# Altium schematic sheet 00-Revision_History_and_Contents.SchDoc: Revision History and Contents
size A; Date: 4/25/2017; ApprovedBy: JSK; CheckedBy: JSK; Author: JSK; CompanyName: University of Wisconsin; DrawnBy: JSK; Engineer: JSK; Organization: ECE 315; Address1: College of Engineering; Address2: 1415 Engineering Drive; Address3: Madison, WI 53706; Address4: ECE 453 Spring 2017; Revision: A; SheetNumber: 1; SheetTotal: 11
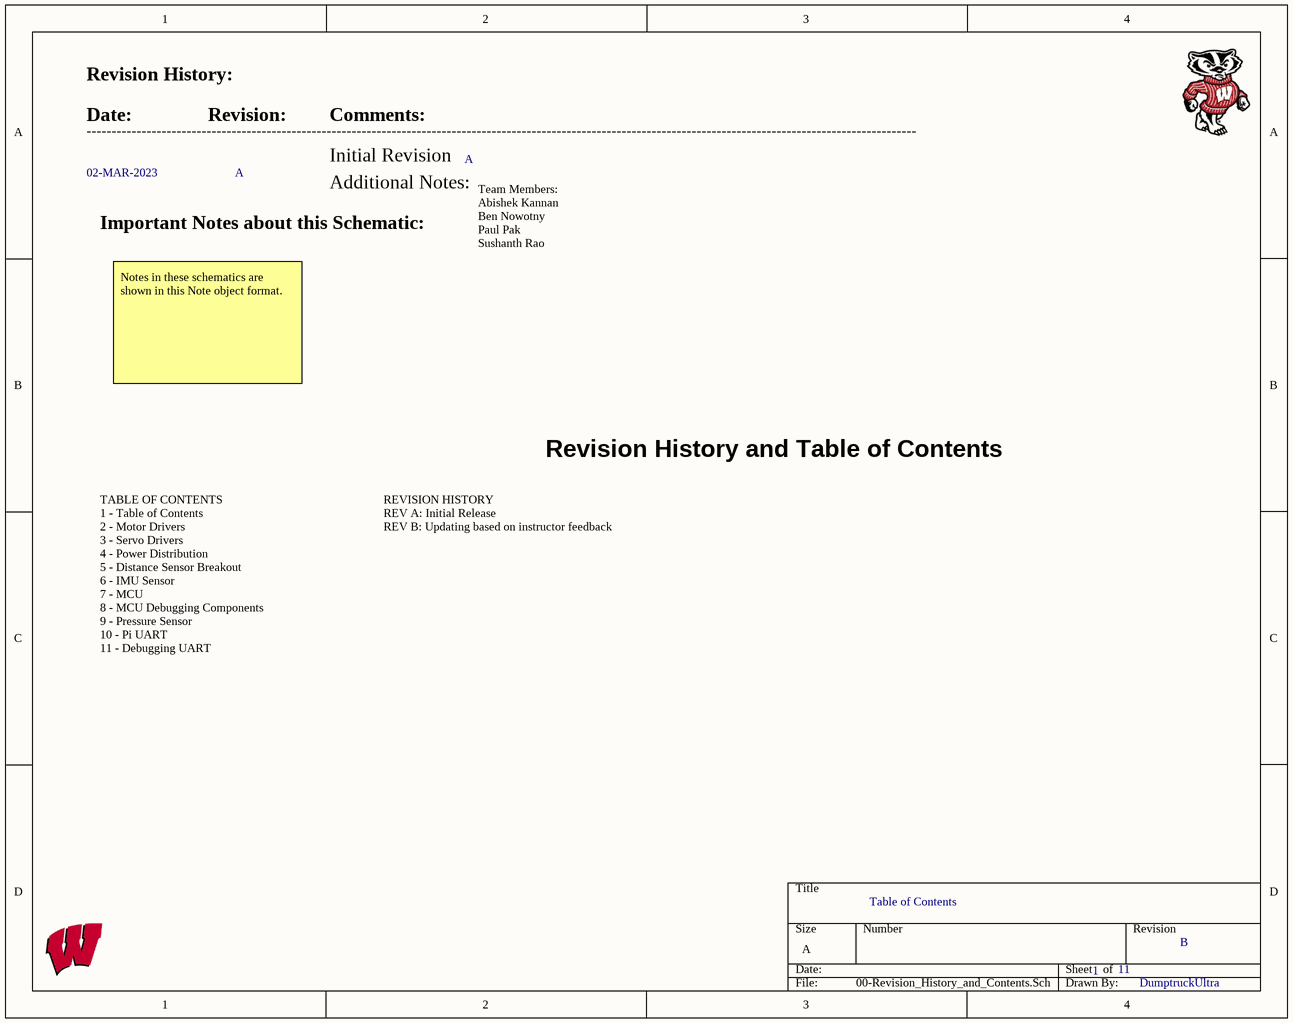
[diagram p0: 00-Revision_History_and_Contents.SchDoc]

## Notes on the sheet
- Revision History:
- Date:
- ----------------------------------------------------------------------------------------------------------------------------------------------------------------------
- Revision:
- Comments:
- Initial Revision
- A
- 02-MAR-2023
- Important Notes about this Schematic:
- Additional Notes:
- Team Members:
  Abishek Kannan
  Ben Nowotny
  Paul Pak
  Sushanth Rao
- Notes in these schematics are shown in this Note object format.
- Revision History and Table of Contents
- TABLE OF CONTENTS
  1 - Table of Contents
  2 - Motor Drivers
  3 - Servo Drivers
  4 - Power Distribution
  5 - Distance Sensor Breakout
  6 - IMU Sensor
  7 - MCU
  8 - MCU Debugging Components
  9 - Pressure Sensor
  10 - Pi UART
  11 - Debugging UART
- REVISION HISTORY
  REV A: Initial Release
  REV B: Updating based on instructor feedback
- Table of Contents
- 1
- 11
- B
- DumptruckUltra